# Altium schematic sheet 02-PowerSupply.SchDoc
size A4
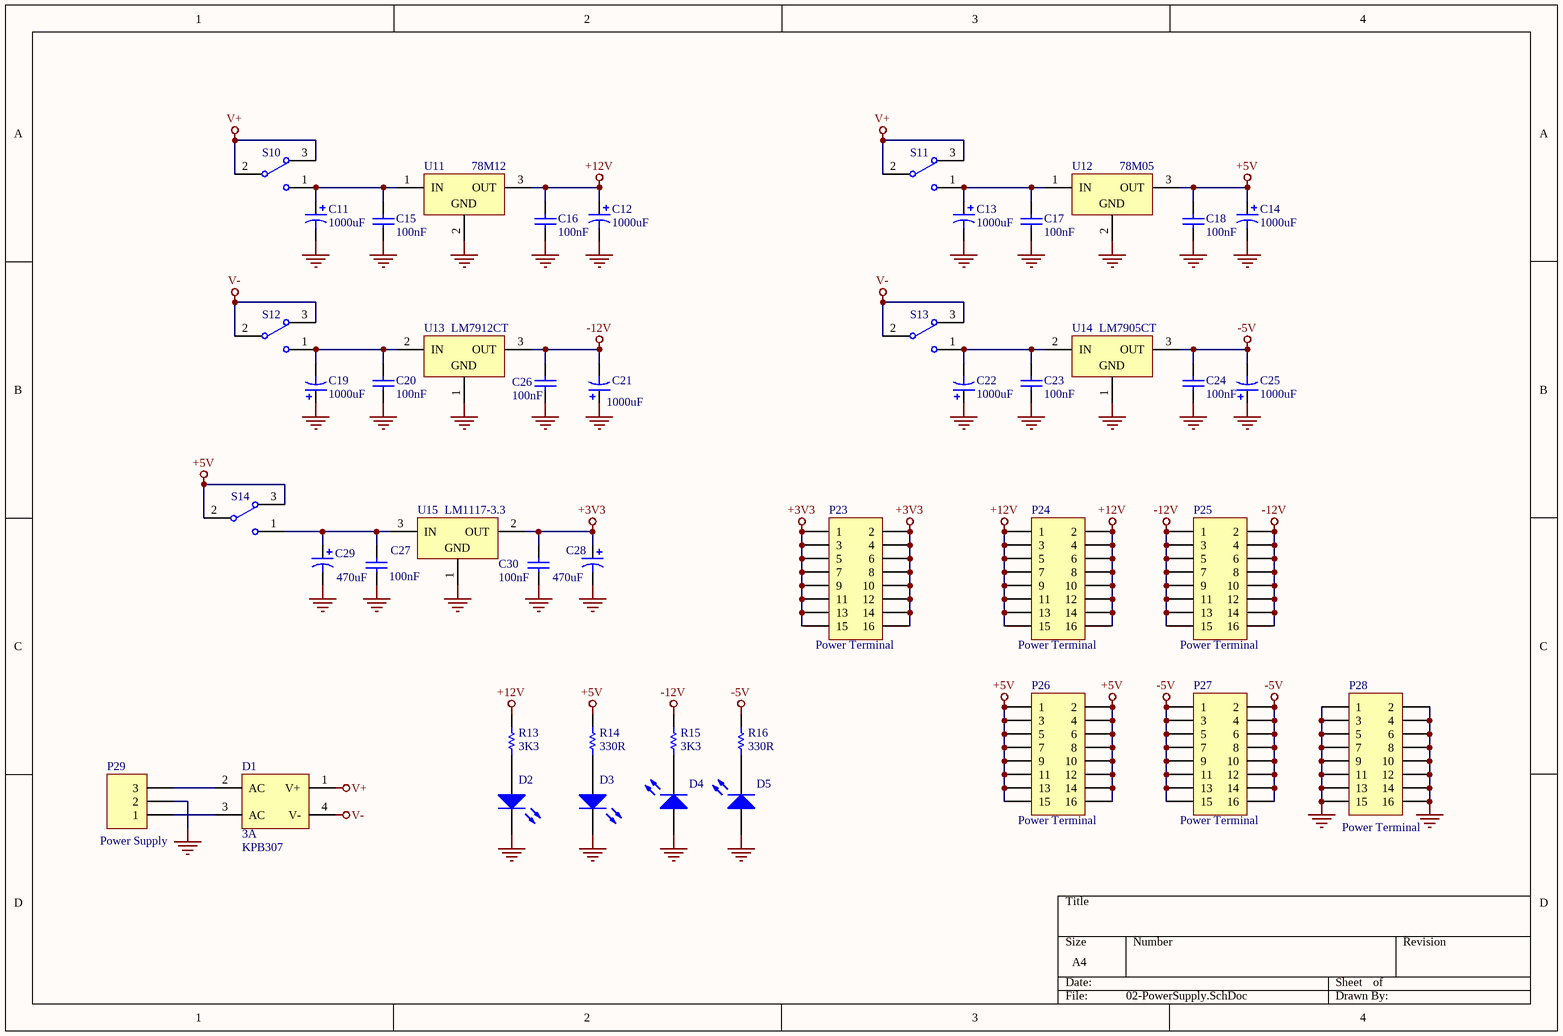
[diagram p0: 02-PowerSupply.SchDoc]

## Parts
C11  value 1000uF  [C-ALU-10x10mm]  (hidden comment: 1000uF/25V)
C12  value 1000uF  [C-ALU-10x10mm]  (hidden comment: 1000uF/25V)
C13  value 1000uF  [C-ALU-10x10mm]  (hidden comment: 1000uF/25V)
C14  value 1000uF  [C-ALU-10x10mm]  (hidden comment: 1000uF/25V)
C15  value 100nF  [C-0805]  (hidden comment: 104)
C16  value 100nF  [C-0805]  (hidden comment: 104)
C17  value 100nF  [C-0805]  (hidden comment: 104)
C18  value 100nF  [C-0805]  (hidden comment: 104)
C19  value 1000uF  [C-ALU-10x10mm]  (hidden comment: 1000uF/25V)
C20  value 100nF  [C-0805]  (hidden comment: 104)
C21  value 1000uF  [C-ALU-10x10mm]  (hidden comment: 1000uF/25V)
C22  value 1000uF  [C-ALU-10x10mm]  (hidden comment: 1000uF/25V)
C23  value 100nF  [C-0805]  (hidden comment: 104)
C24  value 100nF  [C-0805]  (hidden comment: 104)
C25  value 1000uF  [C-ALU-10x10mm]  (hidden comment: 1000uF/25V)
C26  value 100nF  [C-0805]  (hidden comment: 104)
C27  value 100nF  [C-0805]  (hidden comment: 104)
C28  value 470uF  [C-ALU-10x10mm]  (hidden comment: 470uF/16V)
C29  value 470uF  [C-ALU-10x10mm]  (hidden comment: 470uF/16V)
C30  value 100nF  [C-0805]  (hidden comment: 104)
D1  KPB307  value 3A  [D-DB-3A]
D2  LED  [LED-3528]  (value not drawn)
D3  LED  [LED-3528]  (value not drawn)
D4  LED  [LED-3528]  (value not drawn)
D5  LED  [LED-3528]  (value not drawn)
P23  value Power Terminal  [HDR2X8]  (hidden comment: Header 8X2)
P24  value Power Terminal  [HDR2X8]  (hidden comment: Header 8X2)
P25  value Power Terminal  [HDR2X8]  (hidden comment: Header 8X2)
P26  value Power Terminal  [HDR2X8]  (hidden comment: Header 8X2)
P27  value Power Terminal  [HDR2X8]  (hidden comment: Header 8X2)
P28  value Power Terminal  [HDR2X8]  (hidden comment: Header 8X2)
P29  value Power Supply  [HDR1X3]  (hidden comment: H3)
R13  value 3K3  [C-0805]  (hidden comment: 332)
R14  value 330R  [R-0805]  (hidden comment: 331)
R15  value 3K3  [R-0805]  (hidden comment: 332)
R16  value 330R  [R-0805]  (hidden comment: 331)
S10  SW-SPDT  [SW-DIP1SMD]  (value not drawn)
S11  SW-SPDT  [SW-DIP1SMD]  (value not drawn)
S12  SW-SPDT  [SW-DIP1SMD]  (value not drawn)
S13  SW-SPDT  [SW-DIP1SMD]  (value not drawn)
S14  SW-SPDT  [SW-DIP1SMD]  (value not drawn)
U11  78M12  [TO-220-2PC]
U12  78M05  [TO-220-2PC]
U13  LM7912CT  [TO-220-2PC]
U14  LM7905CT  [TO-220-2PC]
U15  LM1117-3.3  [TO-220-2PC]

## Nets
+3V3: C28.1 C30.2 P23.1 P23.2 P23.3 P23.4 P23.5 P23.6 P23.7 P23.8 P23.9 P23.10 P23.11 P23.12 P23.13 P23.14 P23.15 P23.16 U15.2(OUT)
+5V: C14.1 C18.2 P26.1 P26.2 P26.3 P26.4 P26.5 P26.6 P26.7 P26.8 P26.9 P26.10 P26.11 P26.12 P26.13 P26.14 P26.15 P26.16 R14.1 S14.2 S14.3 U12.3(OUT)
+12V: C12.1 C16.2 P24.1 P24.2 P24.3 P24.4 P24.5 P24.6 P24.7 P24.8 P24.9 P24.10 P24.11 P24.12 P24.13 P24.14 P24.15 P24.16 R13.1 U11.3(OUT)
-5V: C24.2 C25.2 P27.1 P27.2 P27.3 P27.4 P27.5 P27.6 P27.7 P27.8 P27.9 P27.10 P27.11 P27.12 P27.13 P27.14 P27.15 P27.16 R16.1 U14.3(OUT)
-12V: C21.2 C26.2 P25.1 P25.2 P25.3 P25.4 P25.5 P25.6 P25.7 P25.8 P25.9 P25.10 P25.11 P25.12 P25.13 P25.14 P25.15 P25.16 R15.1 U13.3(OUT)
GND: C11.2 C12.2 C13.2 C14.2 C15.1 C16.1 C17.1 C18.1 C19.1 C20.1 C21.1 C22.1 C23.1 C24.1 C25.1 C26.1 C27.1 C28.2 C29.2 C30.1 D2.2(K) D3.2(K) D4.1(A) D5.1(A) P28.1 P28.2 P28.3 P28.4 P28.5 P28.6 P28.7 P28.8 P28.9 P28.10 P28.11 P28.12 P28.13 P28.14 P28.15 P28.16 P29.2 U11.2(GND) U12.2(GND) U13.1(GND) U14.1(GND) U15.1(GND)
V+: D1.1(V+) S10.2 S10.3 S11.2 S11.3
V-: D1.4(V-) S12.2 S12.3 S13.2 S13.3
NetC11_1: C11.1 C15.2 S10.1 U11.1(IN)
NetC13_1: C13.1 C17.2 S11.1 U12.1(IN)
NetC19_2: C19.2 C20.2 S12.1 U13.2(IN)
NetC22_2: C22.2 C23.2 S13.1 U14.2(IN)
NetC27_2: C27.2 C29.1 S14.1 U15.3(IN)
NetD1_2: D1.2(AC) P29.3
NetD1_3: D1.3(AC) P29.1
NetD2_1: D2.1(A) R13.2
NetD3_1: D3.1(A) R14.2
NetD4_2: D4.2(K) R15.2
NetD5_2: D5.2(K) R16.2

## Library data of the parts
C11-C14 C19 C21 C22 C25 C28 C29 = Cap Pol1: Polarized Capacitor (Radial); Published: 8-Jun-2000; LatestRevisionDate: 17-Jul-2002; LatestRevisionNote: Re-released for DXP Platform.; PackageReference: RB7.6-15; Publisher: Altium Limited
C15-C18 C20 C23 C24 C26 C27 C30 = Cap: Capacitor; Manufacturer: Generic Components; Class: Passive; Published: 08/06/2000; Publisher: Altium Hobart Technology Centre; SubClass: Capacitor
D1 = Bridge2: Diode Bridge; Published: 24-Mar-1999; LatestRevisionDate: 17-Jul-2002; LatestRevisionNote: Re-released for DXP Platform.; PackageReference: D-46_6A
D2-D5 = LED0: Typical INFRARED GaAs LED; Published: 8-Jun-2000; LatestRevisionDate: 08-Jul-2005; LatestRevisionNote: Mech Layer 1 removed.; PackageReference: LED-0; Publisher: Altium Limited; Value: LED
P23-P28 = Header 8X2: Header, 8-Pin, Dual row; LatestRevisionDate: 17-Jul-2002; LatestRevisionNote: Re-released for DXP Platform.
P29 = Header 3: Header, 3-Pin; LatestRevisionDate: 17-Jul-2002; LatestRevisionNote: Re-released for DXP Platform.
R13-R16 = Res1: Resistor; Published: 8-Jun-2000; LatestRevisionDate: 17-Jul-2002; LatestRevisionNote: Re-released for DXP Platform.; PackageReference: AXIAL-0.3; Publisher: Altium Limited
S10-S14 = SW-SPDT: SPDT Subminiature Toggle Switch, Right Angle Mounting, Vertical Actuation; Published: 24-Mar-1999; LatestRevisionDate: 17-Dec-2003; LatestRevisionNote: Schematic revised, PCB Footprint replaced.; DatasheetVersion: 05-Dec-2000; PackageReference: TL36WW15050; Publisher: Altium Limited; PackageDescription: Switch; 4 Leads; ComponentLink1Description: Manufacturer Link; ComponentLink1URL: http://www.apem.com
U11 U12 = LM78M05CT: 3-Terminal Positive Voltage Regulators, 3-pin TO-220; Manufacturer: National Semiconductor; PackageTopMarking: NSUZXYTTE#*LM341T-5.0*LM78M05CT; PowerWise: N; CompType: LDO IC; Published: 4-Dec-2008; DatasheetVersion: Aug-2005; PackageVersion: revL, Jan-1992; PackageReference: T03B; Publisher: Altium Limited; PackageDescription: TO-220, Molded, 3 Lead, Straight; Supplier 1: Farnell; PartNumber: LM78M05CT; RoHS: N; PinCount: 3; ComponentLink1Description: LM78M05 Datasheet; ComponentLink1URL: http://www.national.com/ds/LM/LM78M05.pdf; ComponentLink2Description: LM78M05 Web Page; ComponentLink2URL: http://www.national.com/pf/LM/LM78M05.html; ComponentLink3Description: T03B Package Page; ComponentLink3URL: http://www.national.com/packaging/folders/t03b.html
  U11: Value: 78M12
  U12: Value: 78M05
U13 U14 = LM79M12CT: 3-Terminal Negative Regulators, 3-pin TO-220; Manufacturer: National Semiconductor; PackageTopMarking: NSUZXYTTE#*LM79M*12CT; PowerWise: N; CompType: LDO IC; Published: 4-Dec-2008; DatasheetVersion: Sep-2001; PackageVersion: revL, Jan-1992; PackageReference: T03B; Publisher: Altium Limited; PackageDescription: TO-220, Molded, 3 Lead, Straight; Supplier 1: Farnell; PartNumber: LM79M12CT; RoHS: N; PinCount: 3; ComponentLink1Description: LM79M12 Datasheet; ComponentLink1URL: http://www.national.com/ds/LM/LM79M12.pdf; ComponentLink2Description: LM79M12 Web Page; ComponentLink2URL: http://www.national.com/pf/LM/LM79M12.html; ComponentLink3Description: T03B Package Page; ComponentLink3URL: http://www.national.com/packaging/folders/t03b.html
  U13: Value: LM7912CT
  U14: Value: LM7905CT
U15 = LM1117IDTX-3.3: 800mA Low-Dropout Linear Regulator, 3-pin TO-252; Manufacturer: National Semiconductor; PackageTopMarking: NSUZXYTT*LM1117*IDT-3.3; PowerWise: N; CompType: LDO IC; Published: 1-Mar-2010; DatasheetVersion: Apr-2006; PackageVersion: revD, Feb-2009; PackageReference: TD03B; Publisher: Altium Limited; PackageDescription: TO252, Molded, Jedec, 6.8 x 6.10 x 2.30mm Body, 3 Lead, 2.28mm Pitch, Surface Mount; PartNumber: LM1117IDTX-3.3; Value: LM1117-3.3; PinCount: 3; Code_JEDEC: TO-252-AA; ComponentLink1Description: LM1117 Datasheet; ComponentLink1URL: http://www.national.com/ds/LM/LM1117.pdf; ComponentLink2Description: LM1117 Web Page; ComponentLink2URL: http://www.national.com/pf/LM/LM1117.html; ComponentLink3Description: TD03B Package Page; ComponentLink3URL: http://www.national.com/packaging/folders/td03b.html